# Altium project xkboard_rp2040.PrjPcb
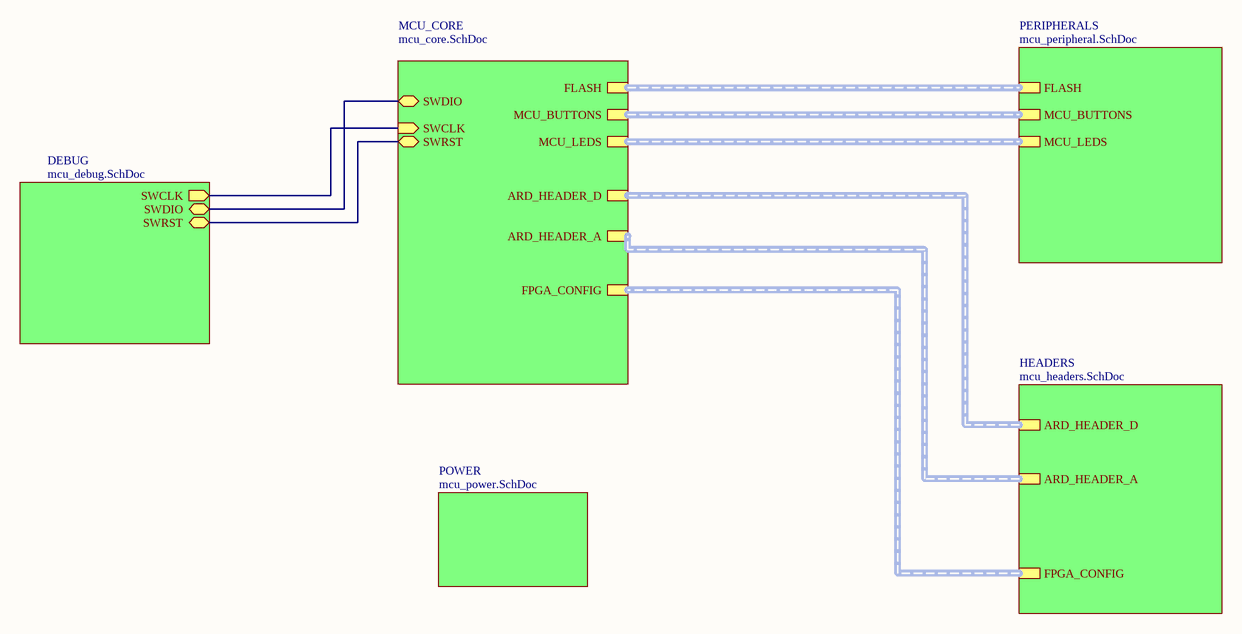
[diagram p0: arm_board.SchDoc]
6 sheets, 73 parts. Net scope: hierarchical (ports join the sheet entries above them; power ports are global).
Board file: rpi_board.PcbDoc
Sheets:
  arm_board.SchDoc
    MCU_CORE = mcu_core.SchDoc
    DEBUG = mcu_debug.SchDoc
    PERIPHERALS = mcu_peripheral.SchDoc
    POWER = mcu_power.SchDoc
    HEADERS = mcu_headers.SchDoc

## Sheet arm_board.SchDoc
size A4

### Sub-sheets
DEBUG = mcu_debug.SchDoc: SWCLK (out), SWDIO (bidir), SWRST (bidir)
HEADERS = mcu_headers.SchDoc: ARD_HEADER_D (harness ARD_HEADER_D), ARD_HEADER_A (harness ARD_HEADER_A), FPGA_CONFIG (harness FPGA_CONFIG)
MCU_CORE = mcu_core.SchDoc: SWDIO (bidir), SWRST (bidir), ARD_HEADER_A (harness ARD_HEADER_A), ARD_HEADER_D (harness ARD_HEADER_D), FPGA_CONFIG (harness FPGA_CONFIG), FLASH (harness FLASH), SWCLK (in), MCU_BUTTONS (harness MCU_BUTTONS), MCU_LEDS (harness MCU_LEDS)
PERIPHERALS = mcu_peripheral.SchDoc: FLASH (harness FLASH), MCU_BUTTONS (harness MCU_BUTTONS), MCU_LEDS (harness MCU_LEDS)
POWER = mcu_power.SchDoc: no entries

### Nets
NetIC1_24: sheet MCU_CORE/SWCLK, sheet DEBUG/SWCLK
NetIC1_25: sheet MCU_CORE/SWDIO, sheet DEBUG/SWDIO
NetP1_10: sheet MCU_CORE/SWRST, sheet DEBUG/SWRST

### Buses and harness runs
harness sheet HEADERS/ARD_HEADER_A = sheet MCU_CORE/ARD_HEADER_A
harness sheet HEADERS/ARD_HEADER_D = sheet MCU_CORE/ARD_HEADER_D
harness sheet HEADERS/FPGA_CONFIG = sheet MCU_CORE/FPGA_CONFIG
harness sheet MCU_CORE/FLASH = sheet PERIPHERALS/FLASH
harness sheet MCU_CORE/MCU_BUTTONS = sheet PERIPHERALS/MCU_BUTTONS
harness sheet MCU_CORE/MCU_LEDS = sheet PERIPHERALS/MCU_LEDS

## Sheet mcu_core.SchDoc
size A4; SheetNumber: 2; SheetTotal: 6
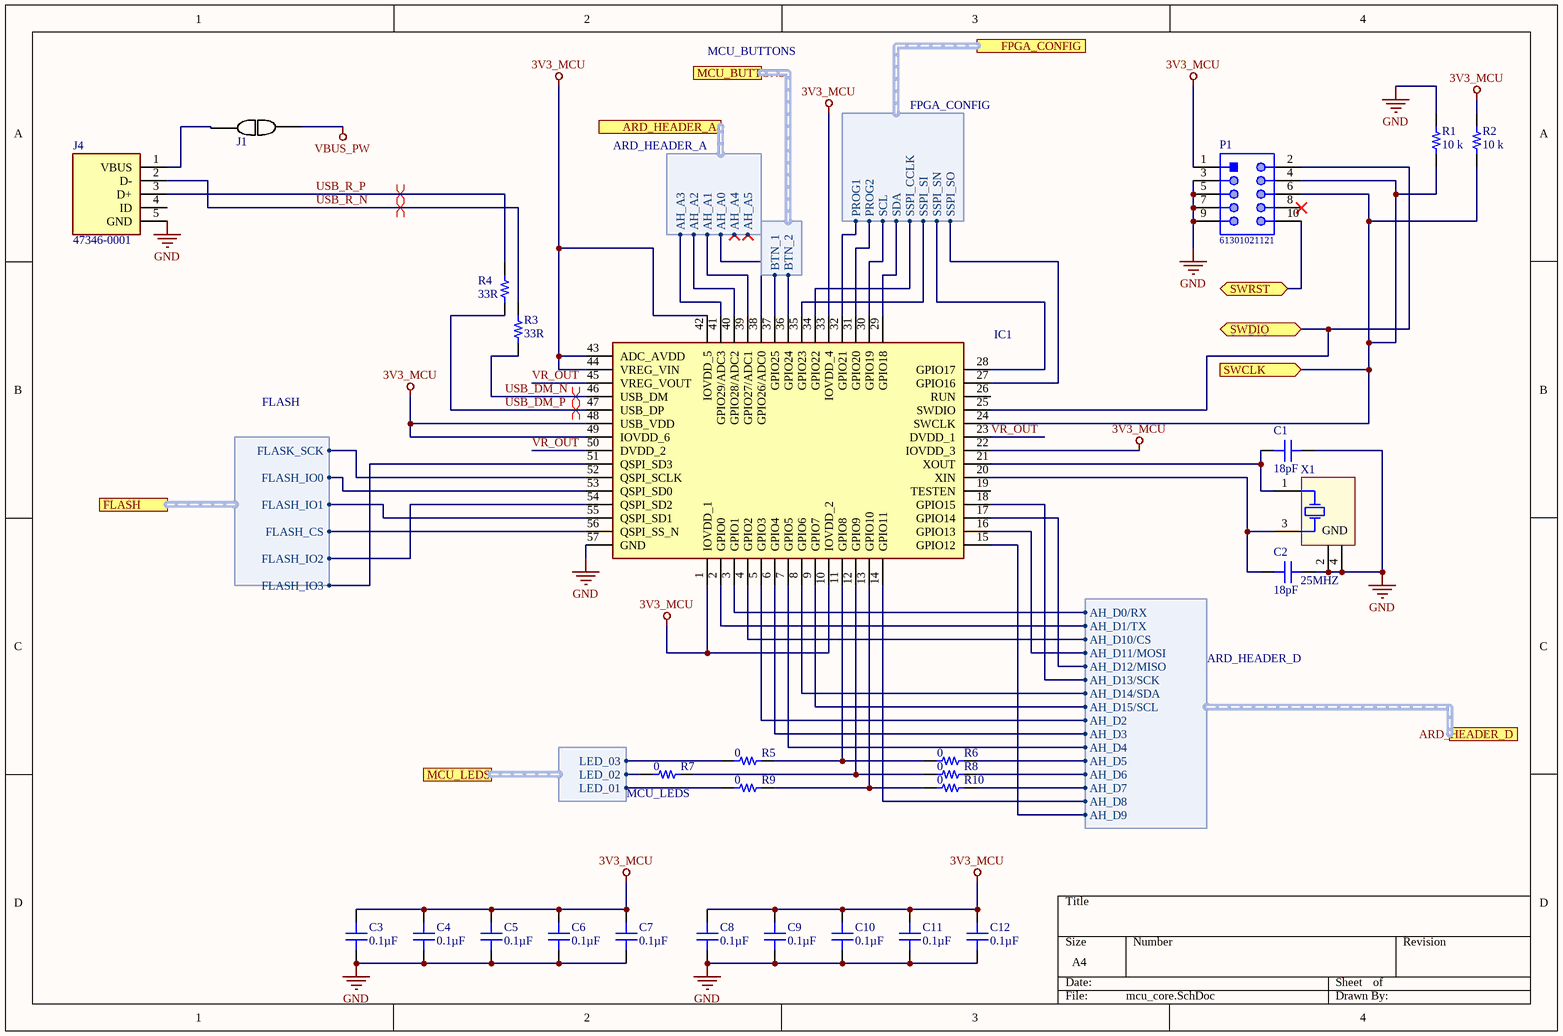
[diagram p1: mcu_core.SchDoc]

### Parts
C1  18pF  [CAP 0603_1608]
C2  18pF  [CAP 0603_1608]
C3  0.1µF  [CAP 0603_1608]
C4  0.1µF  [CAP 0603_1608]
C5  0.1µF  [CAP 0603_1608]
C6  0.1µF  [CAP 0603_1608]
C7  0.1µF  [CAP 0603_1608]
C8  0.1µF  [CAP 0603_1608]
C9  0.1µF  [CAP 0603_1608]
C10  0.1µF  [CAP 0603_1608]
C11  0.1µF  [CAP 0603_1608]
C12  0.1µF  [CAP 0603_1608]
IC1  (no value)  [QFN40P700X700X90-57N-D]
J1  103185-2  [HDRV2W89P0X254_1X2_467X234X820P]  (value not drawn)
J4  47346-0001  [47346-0001]
P1  61301021121  [61301021121]
R1  10 k  [RES 0603_1608]
R2  10 k  [RES 0603_1608]
R3  33R  [RES 0603_1608]
R4  33R  [RES 0603_1608]
R5  0  [RES 0603_1608]
R6  0  [RES 0603_1608]
R7  0  [RES 0603_1608]
R8  0  [RES 0603_1608]
R9  0  [RES 0603_1608]
R10  0  [RES 0603_1608]
X1  25MHZ  [ABRA-ABMM2-4_V]

### Ports
ARD_HEADER_A (harness ARD_HEADER_A), ARD_HEADER_D (harness ARD_HEADER_D), FLASH (harness FLASH), FPGA_CONFIG (harness FPGA_CONFIG), MCU_BUTTONS (harness MCU_BUTTONS), MCU_LEDS (harness MCU_LEDS), SWCLK (in), SWDIO (bidir), SWRST (bidir)

### Harnesses
ARD_HEADER_A: AH_A0, AH_A1, AH_A2, AH_A3, AH_A4, AH_A5
ARD_HEADER_D: AH_D0/RX, AH_D1/TX, AH_D10/CS, AH_D11/MOSI, AH_D12/MISO, AH_D13/SCK, AH_D14/SDA, AH_D15/SCL, AH_D2, AH_D3, AH_D4, AH_D5, AH_D6, AH_D7, AH_D8, AH_D9
FPGA_CONFIG: PROG1, PROG2, SCL, SDA, SSPI_CCLK, SSPI_SI, SSPI_SN, SSPI_SO
MCU_BUTTONS: BTN_1, BTN_2
MCU_LEDS: LED_01, LED_02, LED_03
FLASH: FLASH_IO3, FLASH_IO2, FLASH_CS, FLASH_IO1, FLASH_IO0, FLASK_SCK

### Nets
3V3_MCU: C3.2 C4.2 C5.2 C6.2 C7.2 C8.2 C9.2 C10.2 C11.2 C12.2 IC1.1(IOVDD_1) IC1.10(IOVDD_2) IC1.22(IOVDD_3) IC1.33(IOVDD_4) IC1.42(IOVDD_5) IC1.43(ADC_AVDD) IC1.44(VREG_VIN) IC1.48(USB_VDD) IC1.49(IOVDD_6) P1.1 R2.2
GND: C1.1 C2.1 C3.1 C4.1 C5.1 C6.1 C7.1 C8.1 C9.1 C10.1 C11.1 C12.1 IC1.57(GND) J4.5(GND) P1.3 P1.5 P1.7 P1.9 R1.2 X1.2(GND) X1.4(GND)
VBUS_PW: J1.1  [project net 5V]
USB_DM_N: IC1.46(USB_DM) R3.1
USB_DM_P: IC1.47(USB_DP) R4.2
USB_R_N: J4.2(D-) R3.2
USB_R_P: J4.3(D+) R4.1
VR_OUT: IC1.23(DVDD_1) IC1.45(VREG_VOUT) IC1.50(DVDD_2)
NetC1_2: C1.2 IC1.21(XOUT) X1.1(X1)
NetC2_2: C2.2 IC1.20(XIN) X1.3(X2)
NetD4_2: R9.1 ; port MCU_LEDS.LED_01
NetD5_2: R7.1 ; port MCU_LEDS.LED_02
NetD6_2: R5.1 ; port MCU_LEDS.LED_03
NetIC1_2: IC1.2(GPIO0) ; port ARD_HEADER_D.AH_D1/TX
NetIC1_3: IC1.3(GPIO1) ; port ARD_HEADER_D.AH_D0/RX
NetIC1_4: IC1.4(GPIO2) ; port ARD_HEADER_D.AH_D10/CS
NetIC1_5: IC1.5(GPIO3) ; port ARD_HEADER_D.AH_D2
NetIC1_6: IC1.6(GPIO4) ; port ARD_HEADER_D.AH_D3
NetIC1_7: IC1.7(GPIO5) ; port ARD_HEADER_D.AH_D4
NetIC1_8: IC1.8(GPIO6) ; port ARD_HEADER_D.AH_D14/SDA
NetIC1_9: IC1.9(GPIO7) ; port ARD_HEADER_D.AH_D15/SCL
NetIC1_11: IC1.11(GPIO8) R5.2 R6.1
NetIC1_12: IC1.12(GPIO9) R7.2 R8.1
NetIC1_13: IC1.13(GPIO10) R9.2 R10.1
NetIC1_14: IC1.14(GPIO11) ; port ARD_HEADER_D.AH_D8
NetIC1_15: IC1.15(GPIO12) ; port ARD_HEADER_D.AH_D9
NetIC1_16: IC1.16(GPIO13) ; port ARD_HEADER_D.AH_D11/MOSI
NetIC1_17: IC1.17(GPIO14) ; port ARD_HEADER_D.AH_D12/MISO
NetIC1_18: IC1.18(GPIO15) ; port ARD_HEADER_D.AH_D13/SCK
NetIC1_24: IC1.24(SWCLK) P1.4 P1.6 R1.1 R2.1 ; port SWCLK
NetIC1_25: IC1.25(SWDIO) P1.2 ; port SWDIO
NetIC1_27: IC1.27(GPIO16) ; port FPGA_CONFIG.SSPI_SO
NetIC1_28: IC1.28(GPIO17) ; port FPGA_CONFIG.SSPI_SN
NetIC1_29: IC1.29(GPIO18) ; port FPGA_CONFIG.SDA
NetIC1_30: IC1.30(GPIO19) ; port FPGA_CONFIG.SCL
NetIC1_31: IC1.31(GPIO20) ; port FPGA_CONFIG.PROG2
NetIC1_32: IC1.32(GPIO21) ; port FPGA_CONFIG.PROG1
NetIC1_34: IC1.34(GPIO22) ; port FPGA_CONFIG.SSPI_CCLK
NetIC1_35: IC1.35(GPIO23) ; port FPGA_CONFIG.SSPI_SI
NetIC1_36: IC1.36(GPIO24) ; port MCU_BUTTONS.BTN_2
NetIC1_37: IC1.37(GPIO25) ; port MCU_BUTTONS.BTN_1
NetIC1_38: IC1.38(GPIO26/ADC0) ; port ARD_HEADER_A.AH_A0
NetIC1_39: IC1.39(GPIO27/ADC1) ; port ARD_HEADER_A.AH_A1
NetIC1_40: IC1.40(GPIO28/ADC2) ; port ARD_HEADER_A.AH_A2
NetIC1_41: IC1.41(GPIO29/ADC3) ; port ARD_HEADER_A.AH_A3
NetIC1_51: IC1.51(QSPI_SD3) ; port FLASH.FLASH_IO3
NetIC1_52: IC1.52(QSPI_SCLK) ; port FLASH.FLASK_SCK
NetIC1_53: IC1.53(QSPI_SD0) ; port FLASH.FLASH_IO0
NetIC1_54: IC1.54(QSPI_SD2) ; port FLASH.FLASH_IO2
NetIC1_55: IC1.55(QSPI_SD1) ; port FLASH.FLASH_IO1
NetIC1_56: IC1.56(QSPI_SS_N) ; port FLASH.FLASH_CS
NetJ1_2: J1.2 J4.1(VBUS)
NetJ3_20: R6.2 ; port ARD_HEADER_D.AH_D5
NetJ3_21: R8.2 ; port ARD_HEADER_D.AH_D6
NetJ3_22: R10.2 ; port ARD_HEADER_D.AH_D7
NetP1_10: P1.10 ; port SWRST

Not connected (* = marked no-connect by the designer): IC1 19(TESTEN) 26(RUN); J4 4(ID); P1 8*

### Layout directives
differential pair: USB_DM_N, USB_DM_P, USB_R_N, USB_R_P

### Library data of the parts
C1 C2 = VJ0603A180FXQCW1BC: CAP CER 18PF 10V C0G/NP0 0603; Manufacturer: Vishay Vitramon; Temperature Coefficient: C0G, NP0; Tolerance: ±1%; Part Number: VJ0603A180FXQCW1BC; Value: 18pF; Applications: General Purpose; Capacitance: 18pF; ComponentLink1Description: Datasheet; ComponentLink1URL: https://www.vishay.com/docs/28548/vjw1bcbascomseries.pdf; ComponentLink2Description: DigiKey Link; ComponentLink2URL: http://digikey.com/product-detail/en/vishay-vitramon/VJ0603A180FXQCW1BC/720-1660-1-ND/8324080; Device Package: 0603 (1608 Metric); LastUpdated: 02.09.2020 1:03:27; Lifecycle Status: Active; Minimum Order: 1; Mounting Type: Surface Mount, MLCC; Operating Temperature: -55°C ~ 125°C; Package / Case: 0603 (1608 Metric); Packaging: TapeAndReel; PartId: 7094; Part Status: Active; Price: 0.04; Series: VJ; Size / Dimension: 0.063" L x 0.031" W (1.60mm x 0.80mm); Supplier 1: DigiKey; Supplier Part Number 1: 720-1660-1-ND; Thickness (Max): 0.034" (0.87mm); Voltage - Rated: 10V
C3-C12 = C0603C104K5RAC7411: CAP CER 0.1UF 50V X7R 0603; Manufacturer: KEMET; Tolerance: ±10%; Part Number: C0603C104K5RAC7411; Value: 0.1µF; Applications: Bypass, Decoupling; Capacitance: 0.1µF; ComponentLink1Description: Datasheet; ComponentLink1URL: https://api.kemet.com/component-edge/download/datasheet/C0603C104K5RAC7411.pdf; ComponentLink2Description: DigiKey Link; ComponentLink2URL: http://digikey.com/product-detail/en/kemet/C0603C104K5RAC7411/399-7374-2-ND/3317013; Device Package: 0603 (1608 Metric); LastUpdated: 02.09.2020 1:03:36; Lifecycle Status: Active; Minimum Order: 15000; Mounting Type: Surface Mount, MLCC; Operating Temperature: -55°C ~ 125°C; Package / Case: 0603 (1608 Metric); Packaging: TapeAndReel; PartId: 2233; Part Status: Active; Price: 0.02; Series: SMD Comm X7R; Size / Dimension: 0.063" L x 0.031" W (1.60mm x 0.80mm); Supplier 1: DigiKey; Supplier Part Number 1: 399-7374-2-ND; Temperature Coefficient: X7R; Thickness (Max): 0.035" (0.90mm); Voltage - Rated: 50V
IC1 = RP2040: Integrated Circuit; Manufacturer_Name: RASPBERRY-PI; Datasheet Link: https://datasheets.raspberrypi.org/rp2040/rp2040-datasheet.pdf; Height: 0.9mm; Manufacturer_Part_Number: RP2040
J1 = 103185-2: 02 MODII HDR SRST B/A .100CL; Package: None; Price: None; Value: *; MP: 103185-2; Availability: Unavailable
J4 = 47346-0001: Connector; Manufacturer_Name: Molex; Datasheet Link: http://www.molex.com/pdm_docs/sd/473460001_sd.pdf; Manufacturer_Part_Number: 47346-0001; Mouser Part Number: 538-47346-0001; Mouser Price/Stock: https://www.mouser.co.uk/ProductDetail/Molex/47346-0001?qs=c2CV6XM0DweJBWaSeyWeCw%3D%3D
P1 = CMP-1502-01084-1: THT Vertical Pin Header WR-PHD, Pitch 2.54 mm, Dual Row, 10 pins; Manufacturer: Wurth Elektronik; Working Voltage: 250VAC; Pitch: 2.54mm; Contact Resistance: 20mOhm; Gender: Male; Rated Current: 3A; Withstanding Voltage: 500VAC; Pin Number: 10; Operating Temperature: -40to105degC; Mounting Technology: THT; Publisher: WurthElektronik; Manufacturer URL: http://www.we-online.de; Part Number: 61301021121; Row Number: Dual; Packaging: Bag; Orientation: Vertical; Package Reference: 61301021121; Datasheet URL: https://katalog.we-online.de/em/datasheet/6130xx21121.pdf
R1 R2 = RNCS0603BKE10K0: RES 10K OHM 0.1% 1/16W 0603; Manufacturer: Stackpole Electronics Inc; Power (Watts): 0.063W, 1/16W; Resistance: 10 kOhms; Temperature Coefficient: ±25ppm/°C; Part Number: RNCS0603BKE10K0; Value: 10 k; ComponentLink1Description: Datasheet; ComponentLink1URL: https://www.seielect.com/catalog/sei-rncs_rnch.pdf; ComponentLink2Description: DigiKey Link; ComponentLink2URL: http://digikey.com/product-detail/en/stackpole-electronics-inc/RNCS0603BKE10K0/RNCS0603BKE10K0CT-ND/1800113; Composition: Thin Film; Device Package: 0603 (1608 Metric); Features: Anti-Corrosive, Automotive AEC-Q200, Moisture Resistant; Height - Seated (Max): 0.022" (0.55mm); LastUpdated: 02.09.2020 1:10:25; Lifecycle Status: Active; Minimum Order: 1; Number of Terminations: 2; Operating Temperature: -55°C ~ 155°C; Package / Case: 0603 (1608 Metric); Packaging: TapeAndReel; PartId: 4838; Part Status: Active; Price: 0.08; Ratings: AEC-Q200; Series: RNCS; Size / Dimension: 0.061" L x 0.031" W (1.55mm x 0.80mm); Supplier 1: DigiKey; Supplier Part Number 1: RNCS0603BKE10K0CT-ND; Supplier Device Package: 0603; Tolerance: ±0.1%
R3 R4 = CPF0603B33RE: RES SMD 33 OHM 0.1% 1/16W 0603; Manufacturer: TE Connectivity Passive Product; Power (Watts): 0.063W, 1/16W; Resistance: 33 Ohms; Temperature Coefficient: ±25ppm/°C; Part Number: CPF0603B33RE; Value: 33R; ComponentLink1Description: Datasheet; ComponentLink1URL: https://www.te.com/commerce/DocumentDelivery/DDEController?Action=srchrtrv&DocNm=1773200&DocType=DS&DocLang=English; ComponentLink2Description: DigiKey Link; ComponentLink2URL: http://digikey.com/product-detail/en/te-connectivity-passive-product/CPF0603B33RE/A119909CT-ND/4966507; Composition: Thin Film; Device Package: 0603 (1608 Metric); Height - Seated (Max): 0.022" (0.55mm); LastUpdated: 02.09.2020 1:10:25; Lifecycle Status: Active; Minimum Order: 1; Number of Terminations: 2; Operating Temperature: -55°C ~ 155°C; Package / Case: 0603 (1608 Metric); Packaging: TapeAndReel; PartId: 4881; Part Status: Active; Price: 0.09; Series: CPF, Neohm; Size / Dimension: 0.061" L x 0.031" W (1.55mm x 0.80mm); Supplier 1: DigiKey; Supplier Part Number 1: A119909CT-ND; Supplier Device Package: 0603; Tolerance: ±0.1%
R5-R10 = TLRZ1JTTD: RES 0 OHM JUMPER 0603; Manufacturer: KOA Speer Electronics, Inc.; Part Number: TLRZ1JTTD; ComponentLink1Description: Datasheet; ComponentLink1URL: http://www.koaspeer.com/catimages/Products/TLRZ/TLRZ.pdf; ComponentLink2Description: DigiKey Link; ComponentLink2URL: http://digikey.com/product-detail/en/koa-speer-electronics-inc/TLRZ1JTTD/2019-TLRZ1JTTDCT-ND/9847537; Composition: Metal Element; Device Package: 0603 (1608 Metric); Features: Automotive AEC-Q200, Current Sense; Height - Seated (Max): 0.022" (0.55mm); LastUpdated: 02.09.2020 1:10:25; Lifecycle Status: Active; Minimum Order: 1; Number of Terminations: 2; Operating Temperature: -55°C ~ 170°C; Package / Case: 0603 (1608 Metric); Packaging: TapeAndReel; PartId: 4851; Part Status: Active; Price: 0.08; Ratings: AEC-Q200; Series: TLRZ; Size / Dimension: 0.063" L x 0.031" W (1.60mm x 0.80mm); Supplier 1: DigiKey; Supplier Part Number 1: 2019-TLRZ1JTTDCT-ND; Supplier Device Package: 0603; Tolerance: Jumper
X1 = CMP-0277-00003-1: Ceramic Surface Mount Low Profile Quartz Crystal, 8 MHz, -20 to 70 degC, 4-Pin 6 x 3.6 x 1.2 mm SMD, RoHS, 1000pcs / Reel; Manufacturer: Abracon; PartNumber: ABMM2-8.000MHZ-E2-T; ESR: 72 Ohm Max.; Frequency: 8 MHz; Shunt Capacitance C0: 7 pF Max.; Load Capacitance CL: 18 pF Typ.; ComponentLink3Description: Package Specification; PackageDescription: 4-Pin SMD, Body 6 x 3.6 mm, Pitch 4.4 mm; DatasheetVersion: Jan-13; ComponentLink1URL: http://www.abracon.com/; ComponentLink2URL: http://www.abracon.com/Resonators/ABMM2.pdf; Temperature Range: -20 to 70 degC; Mounting Technology: Surface Mount; RoHS: TRUE; ComponentLink2Description: Datasheet; ComponentLink3URL: http://www.abracon.com/Resonators/ABMM2.pdf; ComponentLink1Description: Manufacturer URL; Packing: 1000pcs / Reel

## Sheet mcu_debug.SchDoc: ARM debug probe
size A4; Author: Pavel Koupý; Revision: 1.0; SheetNumber: 3; SheetTotal: 6
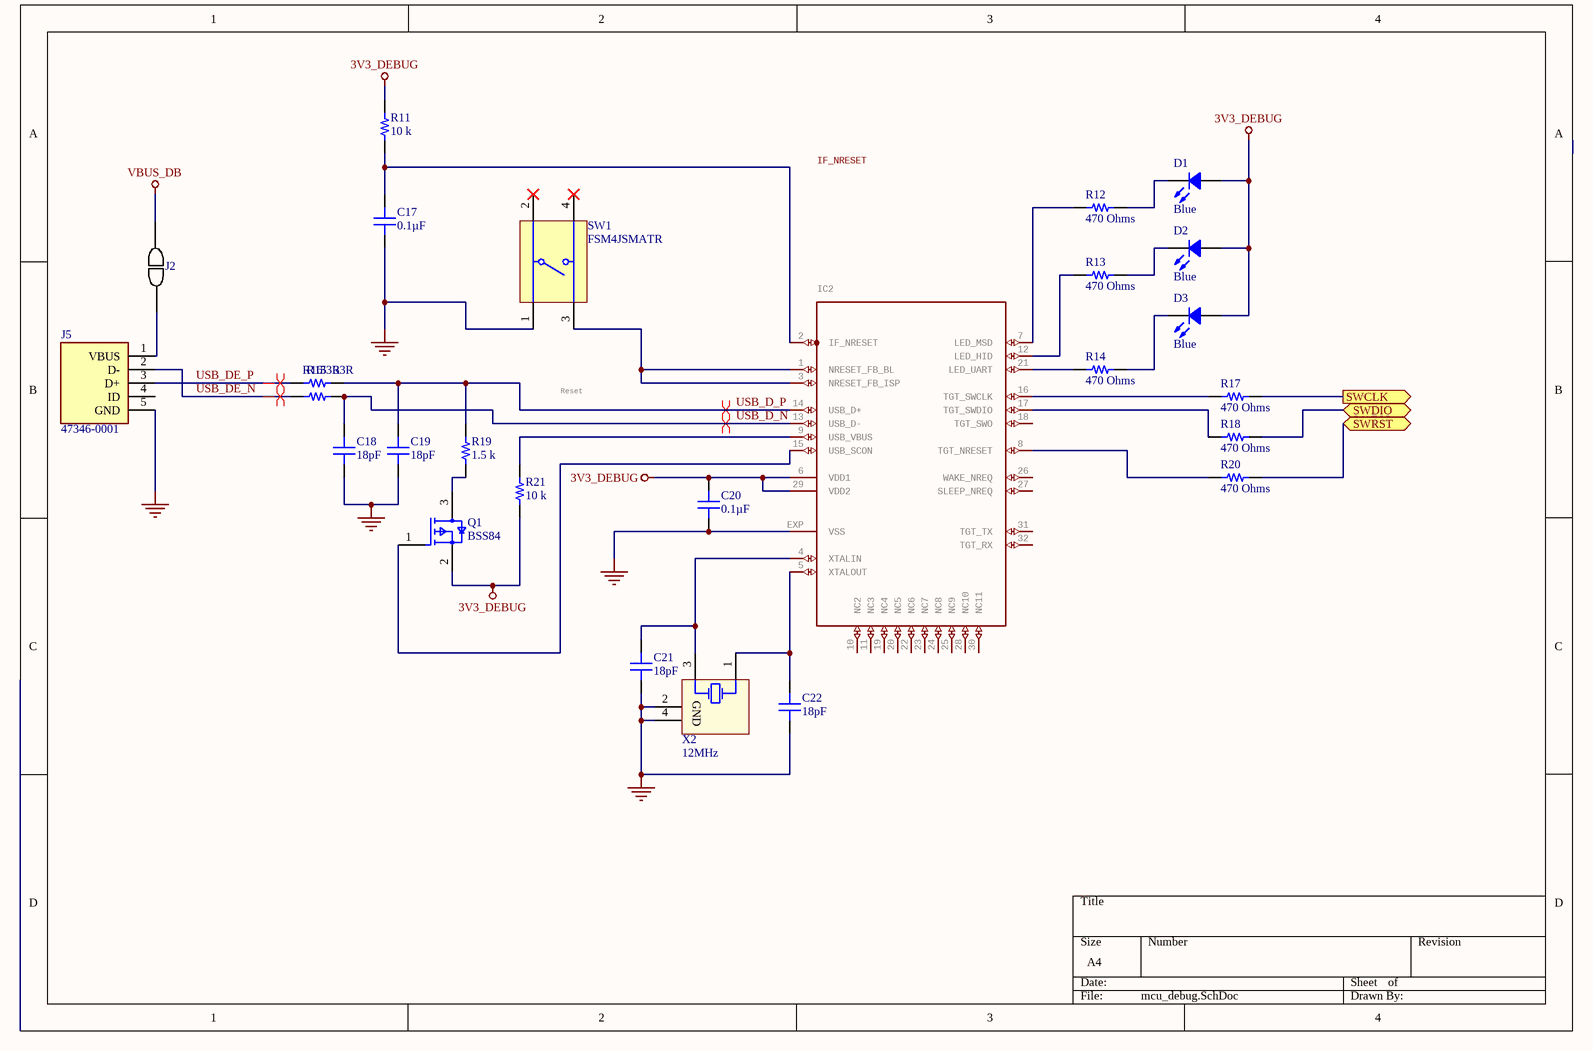
[diagram p2: mcu_debug.SchDoc]

### Parts
C17  0.1µF  [CAP 0603_1608]
C18  18pF  [CAP 0603_1608]
C19  18pF  [CAP 0603_1608]
C20  0.1µF  [CAP 0603_1608]
C21  18pF  [CAP 0603_1608]
C22  18pF  [CAP 0603_1608]
D1  Blue  [LED 0603_1608 BLUE]
D2  Blue  [LED 0603_1608 BLUE]
D3  Blue  [LED 0603_1608 BLUE]
IC2  CMSIS-DAP Interface : 32-bit LPC11U00 ARM Cortex M3 RISC 64KB Flash 2.5V/3.3V 33-Pin HVQFN EP  [HVQFN33]  (value not drawn)
J2  103185-2  [HDRV2W89P0X254_1X2_467X234X820P]  (value not drawn)
J5  47346-0001  [47346-0001]
Q1  BSS84  [FP-SOT23-MFG]
R11  10 k  [RES 0603_1608]
R12  470 Ohms  [RES 0603_1608]
R13  470 Ohms  [RES 0603_1608]
R14  470 Ohms  [RES 0603_1608]
R15  33R  [RES 0603_1608]
R16  33R  [RES 0603_1608]
R17  470 Ohms  [RES 0603_1608]
R18  470 Ohms  [RES 0603_1608]
R19  1.5 k  [RES 0603_1608]
R20  470 Ohms  [RES 0603_1608]
R21  10 k  [RES 0603_1608]
SW1  FSM4JSMATR  [TECO-FSM4JSMATR_V]
X2  12MHz  [ABRA-ABMM2-4_V]

### Ports
SWCLK (out), SWDIO (bidir), SWRST (bidir)

### Nets
3V3_DEBUG: C20.2 D1.1 D2.1 D3.1 IC2.6(VDD1) IC2.29(VDD2) Q1.2(S) R11.2 R21.1
GND: C17.1 C18.1 C19.1 C20.1 C21.1 C22.1 IC2.EXP(VSS) J5.5(GND) SW1.1 X2.2(GND) X2.4(GND)
VBUS_DB: J2.1  [project net 5V]
USB_D_N: C18.2 IC2.13(USB_D-) R15.2
USB_D_P: C19.2 IC2.14(USB_D+) R16.2 R19.2
USB_DE_N: J5.2(D-) R15.1
USB_DE_P: J5.3(D+) R16.1
NetC17_2: C17.2 IC2.2(IF_NRESET) R11.1
NetC21_2: C21.2 IC2.4(XTALIN) X2.3(X2)
NetC22_2: C22.2 IC2.5(XTALOUT) X2.1(X1)
NetD1_2: D1.2 R12.2
NetD2_2: D2.2 R13.2
NetD3_2: D3.2 R14.2
NetIC1_24: R17.2 ; port SWCLK
NetIC1_25: R18.2 ; port SWDIO
NetIC2_1: IC2.1(NRESET_FB_BL) IC2.3(NRESET_FB_ISP) SW1.3
NetIC2_7: IC2.7(LED_MSD) R12.1
NetIC2_8: IC2.8(TGT_NRESET) R20.1
NetIC2_9: IC2.9(USB_VBUS) R21.2
NetIC2_12: IC2.12(LED_HID) R13.1
NetIC2_15: IC2.15(USB_SCON) Q1.1(G)
NetIC2_16: IC2.16(TGT_SWCLK) R17.1
NetIC2_17: IC2.17(TGT_SWDIO) R18.1
NetIC2_21: IC2.21(LED_UART) R14.1
NetJ2_2: J2.2 J5.1(VBUS)
NetP1_10: R20.2 ; port SWRST
NetQ1_3: Q1.3(D) R19.1

Not connected (* = marked no-connect by the designer): IC2 10(NC2) 11(NC3) 18(TGT_SWO) 19(NC4) 20(NC5) 22(NC6) 23(NC7) 24(NC8) 25(NC9) 26(WAKE_NREQ) 27(SLEEP_NREQ) 28(NC10) 30(NC11) 31(TGT_TX) 32(TGT_RX); J5 4(ID); SW1 2* 4*

### Layout directives
differential pair: USB_D_N, USB_D_P, USB_DE_N, USB_DE_P

### Notes on the sheet
- Reset
- Labels drawn without touching a wire or pin: IF_NRESET

### Library data of the parts
C17 C20 = C0603T104K8RAC7867: CAP CER 0.1UF 10V X7R 0603; Manufacturer: KEMET; Ratings: COTS; Tolerance: ±10%; Part Number: C0603T104K8RAC7867; Value: 0.1µF; Applications: High Reliability, Bypass, Decoupling; Capacitance: 0.1µF; ComponentLink1Description: Datasheet; ComponentLink1URL: https://api.kemet.com/component-edge/download/datasheet/C0603T104K8RAC7867.pdf; ComponentLink2Description: DigiKey Link; ComponentLink2URL: http://digikey.com/product-detail/en/kemet/C0603T104K8RAC7867/399-20424-1-ND/9925028; Device Package: 0603 (1608 Metric); LastUpdated: 02.09.2020 1:03:35; Lifecycle Status: Active; Minimum Order: 1; Mounting Type: Surface Mount, MLCC; Operating Temperature: -55°C ~ 125°C; Package / Case: 0603 (1608 Metric); Packaging: TapeAndReel; PartId: 2528; Part Status: Active; Price: 0.23; Series: SMD COTS X7R; Size / Dimension: 0.063" L x 0.031" W (1.60mm x 0.80mm); Supplier 1: DigiKey; Supplier Part Number 1: 399-20424-1-ND; Temperature Coefficient: X7R; Thickness (Max): 0.034" (0.87mm); Voltage - Rated: 10V
C18 C19 C21 C22 = VJ0603A180FXQCW1BC: as C1 on sheet mcu_core; Part Number: VJ0603A180FXQCW1BC; Value: 18pF; Applications: General Purpose; Capacitance: 18pF; ComponentLink1Description: Datasheet; ComponentLink1URL: https://www.vishay.com/docs/28548/vjw1bcbascomseries.pdf; ComponentLink2Description: DigiKey Link; ComponentLink2URL: http://digikey.com/product-detail/en/vishay-vitramon/VJ0603A180FXQCW1BC/720-1660-1-ND/8324080; Device Package: 0603 (1608 Metric); LastUpdated: 02.09.2020 1:03:27; Lifecycle Status: Active; Minimum Order: 1; Mounting Type: Surface Mount, MLCC; Operating Temperature: -55°C ~ 125°C; Package / Case: 0603 (1608 Metric); Packaging: TapeAndReel; PartId: 7094; Part Status: Active; Price: 0.04; Series: VJ; Size / Dimension: 0.063" L x 0.031" W (1.60mm x 0.80mm); Supplier 1: DigiKey; Supplier Part Number 1: 720-1660-1-ND; Thickness (Max): 0.034" (0.87mm); Voltage - Rated: 10V
D1-D3 = VLMB1300-GS08: LED BLUE 0603 SMD; Manufacturer: Vishay Semiconductor Opto Division; Configuration: Standard; Current - Test: 20mA; Lens Color: 1.00mm; Lens Size: 1.10mm x 0.80mm; Lens Style: Rectangle with Flat Top; Millicandela Rating: 104mcd; Viewing Angle: 130°; Voltage - Forward (Vf) (Typ): 3.3V; Wavelength - Dominant: 470nm; Wavelength - Peak: 468nm; Part Number: VLMB1300-GS08; Color: Blue; ComponentLink1Description: Datasheet; ComponentLink1URL: http://www.vishay.com/docs/82437/vlmo1300.pdf; ComponentLink2Description: DigiKey Link; ComponentLink2URL: http://digikey.com/product-detail/en/vishay-semiconductor-opto-division/VLMB1300-GS08/VLMB1300-GS08CT-ND/3025485; Device Package: 0603 (1608 Metric); Height (Max): 1.00mm; LastUpdated: 02.09.2020 1:20:26; Lifecycle Status: Active; Minimum Order: 1; Mounting Type: Surface Mount; Package / Case: 0603 (1608 Metric); Packaging: TapeAndReel; PartId: 785; Part Status: Active; Price: 0.08; Series: CHIPLED; Size / Dimension: 1.60mm L x 0.80mm W; Supplier 1: DigiKey; Supplier Part Number 1: VLMB1300-GS08CT-ND; Supplier Device Package: 0603; Value: Blue
IC2 = IF_LPC11U35FHI33/501: GateName_1: G$1; SymbolName_1: IF-LPC11U35; MF: NXP; LibraryName: mbed-HDK-MF-NXP; DeviceSetName: IF_LPC11U35FHI33/501; Package: HVQFN33; MFN: LPC11U35FHI33/501; OC-DIGIKEY: 568-9586-ND; OC-MOUSER: 771-LPC11U35FHI33501; OC-NEWARK: 2115658; Supplier 1: Farnell; Supplier Part Number 1: 2115658
J2 = 103185-2: 02 MODII HDR SRST B/A .100CL; Package: None; Price: None; Value: *; MP: 103185-2; Availability: Unavailable
J5 = 47346-0001: Connector; Manufacturer_Name: Molex; Datasheet Link: http://www.molex.com/pdm_docs/sd/473460001_sd.pdf; Manufacturer_Part_Number: 47346-0001; Mouser Part Number: 538-47346-0001; Mouser Price/Stock: https://www.mouser.co.uk/ProductDetail/Molex/47346-0001?qs=c2CV6XM0DweJBWaSeyWeCw%3D%3D
Q1 = CMP-14409-000006-1: MOSFET P-CH 50V 130MA SOT-23; Manufacturer Part Number: BSS84,215; Manufacturer: Nexperia USA Inc.; Drain To Source Breakdown Voltage: -50V; Max Junction Temp: +150°C; Threshold Vgs Min: -0.8V; Turn On Delay Time: 3ns; Power Dissipation: 250mW; Turn Off Delay Time: 7ns; Gate To Source Voltage: 20V; Number Of Channels: 1; Input Capacitace At Vds: 25pF @ -25V; Threshold Vgs Max: -2V; Continuous Drain Current: -130mA; Depletion Mode: False; Drain To Source Resistance: 6Ω; Rthja Max: 500K/W; Octopart: https://octopart.com/bss84%2C215-nexperia-78739375; Ipc Land Pattern Name: SOT95P230X100-3; Drain To Source Voltage: -50V; Lead Free: Yes; Temperature Range High: +150°C; Automotive: No; Device Class L2: Transistors; Package: SOT23; ComponentLink2URL: https://assets.nexperia.com/documents/data-sheet/BSS84.pdf; Category: Trans; RoHS: TRUE; Temperature Range Low: -65°C; ComponentLink2Description: Datasheet; Device Class L1: Discrete Semiconductors; Number Of P Channels: 1; Device Class L3: MOSFETs; Height: 1.1mm; Digikey Description: MOSFET P-CH 50V 130MA SOT-23; Temperature: -65°C to +150°C; Footprint Url: https://assets.nexperia.com/documents/outline-drawing/SOT23.pdf
R11 R21 = RNCS0603BKE10K0: as R1 on sheet mcu_core; Part Number: RNCS0603BKE10K0; Value: 10 k; ComponentLink1Description: Datasheet; ComponentLink1URL: https://www.seielect.com/catalog/sei-rncs_rnch.pdf; ComponentLink2Description: DigiKey Link; ComponentLink2URL: http://digikey.com/product-detail/en/stackpole-electronics-inc/RNCS0603BKE10K0/RNCS0603BKE10K0CT-ND/1800113; Composition: Thin Film; Device Package: 0603 (1608 Metric); Features: Anti-Corrosive, Automotive AEC-Q200, Moisture Resistant; Height - Seated (Max): 0.022" (0.55mm); LastUpdated: 02.09.2020 1:10:25; Lifecycle Status: Active; Minimum Order: 1; Number of Terminations: 2; Operating Temperature: -55°C ~ 155°C; Package / Case: 0603 (1608 Metric); Packaging: TapeAndReel; PartId: 4838; Part Status: Active; Price: 0.08; Ratings: AEC-Q200; Series: RNCS; Size / Dimension: 0.061" L x 0.031" W (1.55mm x 0.80mm); Supplier 1: DigiKey; Supplier Part Number 1: RNCS0603BKE10K0CT-ND; Supplier Device Package: 0603; Tolerance: ±0.1%
R12-R14 R17 R18 R20 = CRCW0603470RJNEAHP: RES SMD 470 OHM 5% 1/4W 0603; Manufacturer: Vishay Dale; Power (Watts): 0.25W, 1/4W; Temperature Coefficient: ±200ppm/°C; Part Number: CRCW0603470RJNEAHP; Value: 470 Ohms; ComponentLink1Description: Datasheet; ComponentLink1URL: http://www.vishay.com/docs/20043/crcwhpe3.pdf; ComponentLink2Description: DigiKey Link; ComponentLink2URL: http://digikey.com/product-detail/en/vishay-dale/CRCW0603470RJNEAHP/541-470SACT-ND/2222809; Composition: Thick Film; Device Package: 0603 (1608 Metric); Features: Automotive AEC-Q200, Pulse Withstanding; Height - Seated (Max): 0.022" (0.55mm); LastUpdated: 02.09.2020 1:09:49; Lifecycle Status: Active; Minimum Order: 1; Number of Terminations: 2; Operating Temperature: -55°C ~ 155°C; Package / Case: 0603 (1608 Metric); Packaging: TapeAndReel; PartId: 21320; Part Status: Active; Price: 0.02; Ratings: AEC-Q200; Resistance: 470 Ohms; Series: CRCW-HP; Size / Dimension: 0.063" L x 0.033" W (1.60mm x 0.85mm); Supplier 1: DigiKey; Supplier Part Number 1: 541-470SACT-ND; Supplier Device Package: 0603; Tolerance: ±5%
R15 R16 = CPF0603B33RE: as R3 on sheet mcu_core; Part Number: CPF0603B33RE; Value: 33R; ComponentLink1Description: Datasheet; ComponentLink1URL: https://www.te.com/commerce/DocumentDelivery/DDEController?Action=srchrtrv&DocNm=1773200&DocType=DS&DocLang=English; ComponentLink2Description: DigiKey Link; ComponentLink2URL: http://digikey.com/product-detail/en/te-connectivity-passive-product/CPF0603B33RE/A119909CT-ND/4966507; Composition: Thin Film; Device Package: 0603 (1608 Metric); Height - Seated (Max): 0.022" (0.55mm); LastUpdated: 02.09.2020 1:10:25; Lifecycle Status: Active; Minimum Order: 1; Number of Terminations: 2; Operating Temperature: -55°C ~ 155°C; Package / Case: 0603 (1608 Metric); Packaging: TapeAndReel; PartId: 4881; Part Status: Active; Price: 0.09; Series: CPF, Neohm; Size / Dimension: 0.061" L x 0.031" W (1.55mm x 0.80mm); Supplier 1: DigiKey; Supplier Part Number 1: A119909CT-ND; Supplier Device Package: 0603; Tolerance: ±0.1%
R19 = CRGP0603F1K5: CRGP 0603 1K5 1%; Manufacturer: TE Connectivity Passive Product; Power (Watts): 0.25W, 1/4W; Resistance: 1.5 kOhms; Temperature Coefficient: ±100ppm/°C; Part Number: CRGP0603F1K5; Value: 1.5 k; ComponentLink1Description: Datasheet; ComponentLink1URL: https://www.te.com/commerce/DocumentDelivery/DDEController?Action=srchrtrv&DocNm=9-1773463-9&DocType=DS&DocLang=English; ComponentLink2Description: DigiKey Link; ComponentLink2URL: http://digikey.com/product-detail/en/te-connectivity-passive-product/CRGP0603F1K5/A130418CT-ND/8578250; Composition: Thick Film; Device Package: 0603 (1608 Metric); Features: Pulse Withstanding; Height - Seated (Max): 0.022" (0.55mm); LastUpdated: 02.09.2020 1:10:24; Lifecycle Status: Active; Minimum Order: 1; Number of Terminations: 2; Operating Temperature: -55°C ~ 155°C; Package / Case: 0603 (1608 Metric); Packaging: TapeAndReel; PartId: 5000; Part Status: Active; Price: 0.02; Series: CRGP; Size / Dimension: 0.063" L x 0.031" W (1.60mm x 0.80mm); Supplier 1: DigiKey; Supplier Part Number 1: A130418CT-ND; Supplier Device Package: 0603; Tolerance: ±1%
SW1 = CMP-2000-07486-1: Micro Miniature Push Button Switch FSM JSM, 50 mA, -35 to 85 degC, 4-Pin SMD, RoHS, Tape and Reel; Manufacturer: TE Connectivity; Mechanical Life: 100000Cycles; Current Rating: 50mA; Actuator Material: Polyamide; Max Voltage Rating (DC): 12V; Capacitance: 0f; Illumination Type: Illuminated; Voltage Rating (DC): 24V; Case\/Package: SMD/SMT; Operating Force: 160gf; Contact Resistance: 100mOhm; Actuator Length: 0.055inch; Switch Travel: 0.25mm; Throw Configuration: SPST; Termination: GullWing; Contact Plating: Silver; Orientation: Straight; Mounting Technology: SurfaceMount; REACH SVHC: Unknown; Electrical Life: 100000Cycles; Package Reference: FSM4JSMATR; Max Operating Temperature: 85degC; Manufacturer URL: http://www.te.com/; Package Description: 4-Pin Surface Mount Device, Body 6 x 6 mm, Pitch 4.5 mm; Datasheet Version: Rev. V, 02/2015; Packaging: TapeandReel; Min Operating Temperature: -35degC; Mount: SurfaceMount; Contact Current Rating: 50mA; Contact Material: CopperAlloy; Package Quantity: 1200; Datasheet URL: http://www.te.com/commerce/DocumentDelivery/DDEController?Action=showdoc&DocId=Customer+Drawing%7F2-1437565-7%7FV%7Fpdf%7FEnglish%7FENG_CD_2-1437565-7_V.pdf%7F4-1437565-2; RoHSCompliant: true
X2 = CMP-0277-00003-1: as X1 on sheet mcu_core; ComponentLink3Description: Package Specification; PackageDescription: 4-Pin SMD, Body 6 x 3.6 mm, Pitch 4.4 mm; DatasheetVersion: Jan-13; ComponentLink1URL: http://www.abracon.com/; ComponentLink2URL: http://www.abracon.com/Resonators/ABMM2.pdf; Temperature Range: -20 to 70 degC; Mounting Technology: Surface Mount; RoHS: TRUE; ComponentLink2Description: Datasheet; ComponentLink3URL: http://www.abracon.com/Resonators/ABMM2.pdf; ComponentLink1Description: Manufacturer URL; Packing: 1000pcs / Reel

## Sheet mcu_peripheral.SchDoc
size A4; SheetNumber: 5; SheetTotal: 6
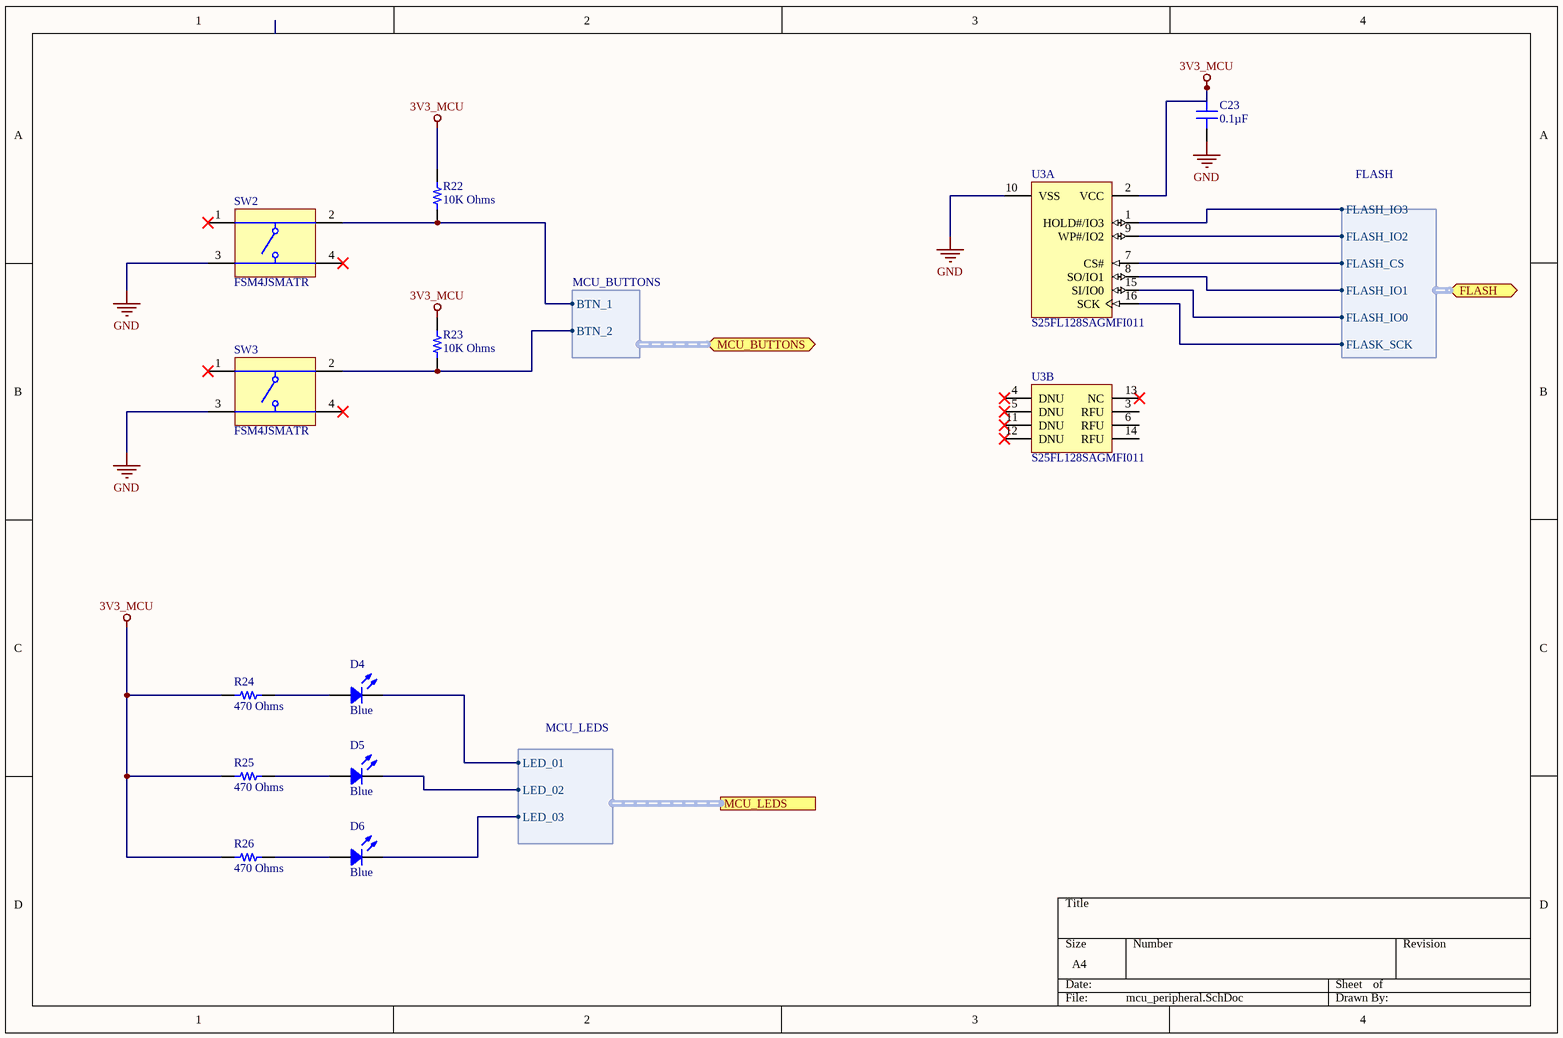
[diagram p3: mcu_peripheral.SchDoc]

### Parts
C23  0.1µF  [CAP 0603_1608]
D4  Blue  [LED 0603_1608 BLUE]
D5  Blue  [LED 0603_1608 BLUE]
D6  Blue  [LED 0603_1608 BLUE]
R22  10K Ohms  [RES 0603_1608]
R23  10K Ohms  [RES 0603_1608]
R24  470 Ohms  [RES 0603_1608]
R25  470 Ohms  [RES 0603_1608]
R26  470 Ohms  [RES 0603_1608]
SW2  FSM4JSMATR  [TECO-FSM4JSMATR_V]
SW3  FSM4JSMATR  [TECO-FSM4JSMATR_V]
U3  S25FL128SAGMFI011  [SPSN-SOIC-16_L]  (parts A,B of 2)

### Ports
FLASH (bidir, harness FLASH), MCU_BUTTONS (bidir, harness MCU_BUTTONS), MCU_LEDS (harness MCU_LEDS)

### Harnesses
MCU_LEDS: LED_01, LED_02, LED_03
FLASH: FLASH_IO3, FLASH_IO2, FLASH_CS, FLASH_IO1, FLASH_IO0, FLASK_SCK
MCU_BUTTONS: BTN_1, BTN_2

### Nets
3V3_MCU: C23.2 R22.2 R23.2 R24.1 R25.1 R26.1 U3.2(VCC)
GND: C23.1 SW2.3 SW3.3 U3.10(VSS)
NetD4_1: D4.1 R24.2
NetD4_2: D4.2 ; port MCU_LEDS.LED_01
NetD5_1: D5.1 R25.2
NetD5_2: D5.2 ; port MCU_LEDS.LED_02
NetD6_1: D6.1 R26.2
NetD6_2: D6.2 ; port MCU_LEDS.LED_03
NetIC1_36: R23.1 SW3.2 ; port MCU_BUTTONS.BTN_2
NetIC1_37: R22.1 SW2.2 ; port MCU_BUTTONS.BTN_1
NetIC1_51: U3.1(HOLD#/IO3) ; port FLASH.FLASH_IO3
NetIC1_52: U3.16(SCK) ; port FLASH.FLASK_SCK
NetIC1_53: U3.15(SI/IO0) ; port FLASH.FLASH_IO0
NetIC1_54: U3.9(WP#/IO2) ; port FLASH.FLASH_IO2
NetIC1_55: U3.8(SO/IO1) ; port FLASH.FLASH_IO1
NetIC1_56: U3.7(CS#) ; port FLASH.FLASH_CS

Not connected (* = marked no-connect by the designer): SW2 1* 4*; SW3 1* 4*; U3 3(RFU) 4(DNU)* 5(DNU)* 6(RFU) 11(DNU)* 12(DNU)* 13(NC)* 14(RFU)

### Library data of the parts
C23 = C0603C104K5RAC7411: as C3 on sheet mcu_core; Part Number: C0603C104K5RAC7411; Value: 0.1µF; Applications: Bypass, Decoupling; Capacitance: 0.1µF; ComponentLink1Description: Datasheet; ComponentLink1URL: https://api.kemet.com/component-edge/download/datasheet/C0603C104K5RAC7411.pdf; ComponentLink2Description: DigiKey Link; ComponentLink2URL: http://digikey.com/product-detail/en/kemet/C0603C104K5RAC7411/399-7374-2-ND/3317013; Device Package: 0603 (1608 Metric); LastUpdated: 02.09.2020 1:03:36; Lifecycle Status: Active; Minimum Order: 15000; Mounting Type: Surface Mount, MLCC; Operating Temperature: -55°C ~ 125°C; Package / Case: 0603 (1608 Metric); Packaging: TapeAndReel; PartId: 2233; Part Status: Active; Price: 0.02; Series: SMD Comm X7R; Size / Dimension: 0.063" L x 0.031" W (1.60mm x 0.80mm); Supplier 1: DigiKey; Supplier Part Number 1: 399-7374-2-ND; Temperature Coefficient: X7R; Thickness (Max): 0.035" (0.90mm); Voltage - Rated: 50V
D4-D6 = VLMB1300-GS08: as D1 on sheet mcu_debug; Part Number: VLMB1300-GS08; Color: Blue; ComponentLink1Description: Datasheet; ComponentLink1URL: http://www.vishay.com/docs/82437/vlmo1300.pdf; ComponentLink2Description: DigiKey Link; ComponentLink2URL: http://digikey.com/product-detail/en/vishay-semiconductor-opto-division/VLMB1300-GS08/VLMB1300-GS08CT-ND/3025485; Device Package: 0603 (1608 Metric); Height (Max): 1.00mm; LastUpdated: 02.09.2020 1:20:26; Lifecycle Status: Active; Minimum Order: 1; Mounting Type: Surface Mount; Package / Case: 0603 (1608 Metric); Packaging: TapeAndReel; PartId: 785; Part Status: Active; Price: 0.08; Series: CHIPLED; Size / Dimension: 1.60mm L x 0.80mm W; Supplier 1: DigiKey; Supplier Part Number 1: VLMB1300-GS08CT-ND; Supplier Device Package: 0603; Value: Blue
R22 R23 = CRCW0603470RJNEAHP: RES SMD 470 OHM 5% 1/4W 0603; Manufacturer: Vishay Dale; Power (Watts): 0.25W, 1/4W; Resistance: 470 Ohms; Temperature Coefficient: ±200ppm/°C; Part Number: CRCW0603470RJNEAHP; Value: 10K Ohms; ComponentLink1Description: Datasheet; ComponentLink1URL: http://www.vishay.com/docs/20043/crcwhpe3.pdf; ComponentLink2Description: DigiKey Link; ComponentLink2URL: http://digikey.com/product-detail/en/vishay-dale/CRCW0603470RJNEAHP/541-470SACT-ND/2222809; Composition: Thick Film; Device Package: 0603 (1608 Metric); Features: Automotive AEC-Q200, Pulse Withstanding; Height - Seated (Max): 0.022" (0.55mm); LastUpdated: 02.09.2020 1:09:49; Lifecycle Status: Active; Minimum Order: 1; Number of Terminations: 2; Operating Temperature: -55°C ~ 155°C; Package / Case: 0603 (1608 Metric); Packaging: TapeAndReel; PartId: 21320; Part Status: Active; Price: 0.02; Ratings: AEC-Q200; Series: CRCW-HP; Size / Dimension: 0.063" L x 0.033" W (1.60mm x 0.85mm); Supplier Device Package: 0603; Tolerance: ±5%; Supplier 1: Farnell; Supplier Part Number 1: 3495224
R24-R26 = CRCW0603470RJNEAHP: as R12 on sheet mcu_debug; Part Number: CRCW0603470RJNEAHP; Value: 470 Ohms; ComponentLink1Description: Datasheet; ComponentLink1URL: http://www.vishay.com/docs/20043/crcwhpe3.pdf; ComponentLink2Description: DigiKey Link; ComponentLink2URL: http://digikey.com/product-detail/en/vishay-dale/CRCW0603470RJNEAHP/541-470SACT-ND/2222809; Composition: Thick Film; Device Package: 0603 (1608 Metric); Features: Automotive AEC-Q200, Pulse Withstanding; Height - Seated (Max): 0.022" (0.55mm); LastUpdated: 02.09.2020 1:09:49; Lifecycle Status: Active; Minimum Order: 1; Number of Terminations: 2; Operating Temperature: -55°C ~ 155°C; Package / Case: 0603 (1608 Metric); Packaging: TapeAndReel; PartId: 21320; Part Status: Active; Price: 0.02; Ratings: AEC-Q200; Resistance: 470 Ohms; Series: CRCW-HP; Size / Dimension: 0.063" L x 0.033" W (1.60mm x 0.85mm); Supplier 1: DigiKey; Supplier Part Number 1: 541-470SACT-ND; Supplier Device Package: 0603; Tolerance: ±5%
SW2 SW3 = CMP-2000-07486-1: as SW1 on sheet mcu_debug; Termination: GullWing; Contact Plating: Silver; Orientation: Straight; Mounting Technology: SurfaceMount; REACH SVHC: Unknown; Electrical Life: 100000Cycles; Package Reference: FSM4JSMATR; Max Operating Temperature: 85degC; Manufacturer URL: http://www.te.com/; Package Description: 4-Pin Surface Mount Device, Body 6 x 6 mm, Pitch 4.5 mm; Datasheet Version: Rev. V, 02/2015; Packaging: TapeandReel; Min Operating Temperature: -35degC; Mount: SurfaceMount; Contact Current Rating: 50mA; Contact Material: CopperAlloy; Package Quantity: 1200; Datasheet URL: http://www.te.com/commerce/DocumentDelivery/DDEController?Action=showdoc&DocId=Customer+Drawing%7F2-1437565-7%7FV%7Fpdf%7FEnglish%7FENG_CD_2-1437565-7_V.pdf%7F4-1437565-2; RoHSCompliant: true
U3 = CMP-1329-00018-1: MirrorBit Flash Non-Volatile Memory CMOS 3.0 Volt Core with Versatile I/O, Serial Peripheral Interface with Multi-I/O, 128 Mbit, 133 MHz, -40 to 85 degC, 16-Pin SO (SO3016), RoHS, Tube; Manufacturer: Spansion; OTP: 1024 B; VCC: 2.7 to 3.6 V; Speed: 133 MHz; PackageDescription: 16-Pin Wide Plastic Small Outline Package, Body 10.3 x 7.5 mm, Pitch 1.27 mm; Density: 128 Mbit; ComponentLink3URL: http://www.spansion.com/Support/Datasheets/S25FL128S_256S_00.pdf; DatasheetVersion: Rev. 08; ComponentLink2Description: Datasheet; ComponentLink3Description: Package Specification; PartNumber: S25FL128SAGMFI011; ComponentLink1Description: Manufacturer URL; ComponentLink1URL: http://www.spansion.com/Pages/Default.aspx; Mounting Technology: Surface Mount; Temperature Range: -40 to 85 degC; ComponentLink2URL: http://www.spansion.com/Support/Datasheets/S25FL128S_256S_00.pdf; RoHS: TRUE; Packing: Tube

## Sheet mcu_power.SchDoc
size A4; SheetNumber: 6; SheetTotal: 6
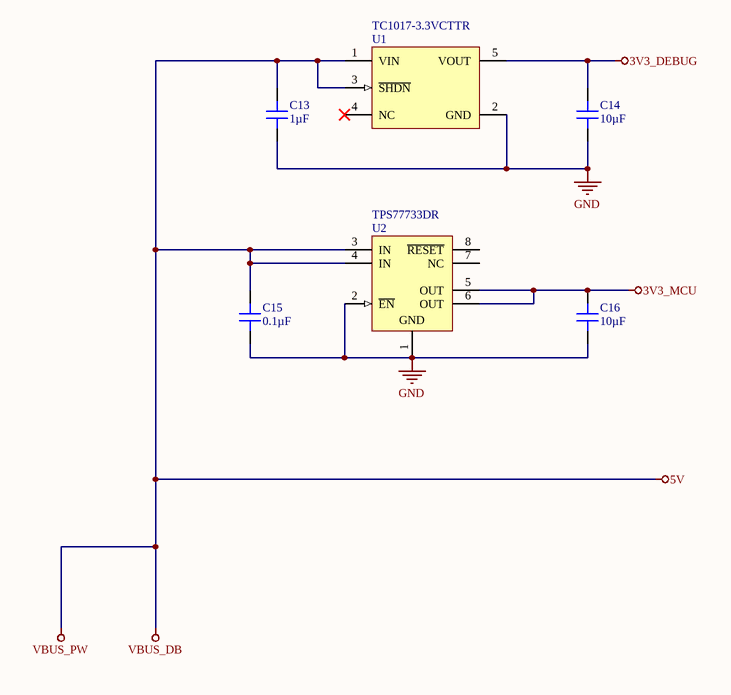
[diagram p4: mcu_power.SchDoc]

### Parts
C13  1µF  [CAP 0603_1608]
C14  10µF  [CAP 0603_1608]
C15  0.1µF  [CAP 0603_1608]
C16  10µF  [CAP 0603_1608]
U1  TC1017-3.3VCTTR  [SOT-23-CT5_L]
U2  TPS77733DR  [D0008A_N]

### Nets
3V3_DEBUG: C14.2 U1.5(VOUT)
3V3_MCU: C16.2 U2.5(OUT) U2.6(OUT)
5V: C13.2 C15.2 U1.1(VIN) U1.3(~{SHDN}) U2.3(IN) U2.4(IN)  [also labelled VBUS_DB, VBUS_PW]
GND: C13.1 C14.1 C15.1 C16.1 U1.2(GND) U2.1(GND) U2.2(~{EN})

Not connected (* = marked no-connect by the designer): U1 4(NC)*; U2 7(NC) 8(~{RESET})

### Library data of the parts
C13 = C0603X105M4RACAUTO: CAP CER 0603 1UF 16V X7R 20%; Manufacturer: KEMET; Part Number: C0603X105M4RACAUTO; Value: 1µF; Applications: Automotive, Boardflex Sensitive; Capacitance: 1µF; ComponentLink1Description: Datasheet; ComponentLink1URL: https://api.kemet.com/component-edge/download/datasheet/C0603X105M4RACAUTO.pdf; ComponentLink2Description: DigiKey Link; ComponentLink2URL: http://digikey.com/product-detail/en/kemet/C0603X105M4RACAUTO/399-17719-1-ND/8635870; Device Package: 0603 (1608 Metric); Features: Soft Termination; LastUpdated: 02.09.2020 1:03:33; Lifecycle Status: Active; Minimum Order: 1; Mounting Type: Surface Mount, MLCC; Operating Temperature: -55°C ~ 125°C; Package / Case: 0603 (1608 Metric); Packaging: TapeAndReel; PartId: 3927; Part Status: Active; Price: 0.07; Ratings: AEC-Q200; Series: SMD Auto X7R Flex; Size / Dimension: 0.063" L x 0.031" W (1.60mm x 0.80mm); Supplier 1: DigiKey; Supplier Part Number 1: 399-17719-1-ND; Temperature Coefficient: X7R; Thickness (Max): 0.037" (0.95mm); Tolerance: ±20%; Voltage - Rated: 16V
C14 C16 = GRT188R61C106KE13D: CAP CER 10UF 16V X5R 0603; Manufacturer: Murata Electronics; Tolerance: ±10%; Part Number: GRT188R61C106KE13D; Value: 10µF; Applications: Automotive; Capacitance: 10µF; ComponentLink1Description: Datasheet; ComponentLink1URL: https://search.murata.co.jp/Ceramy/image/img/A01X/G101/ENG/GRT188R61C106KE13-01.pdf; ComponentLink2Description: DigiKey Link; ComponentLink2URL: http://digikey.com/product-detail/en/murata-electronics/GRT188R61C106KE13D/490-12317-1-ND/5417018; Device Package: 0603 (1608 Metric); LastUpdated: 02.09.2020 1:03:11; Lifecycle Status: Active; Minimum Order: 1; Mounting Type: Surface Mount, MLCC; Operating Temperature: -55°C ~ 85°C; Package / Case: 0603 (1608 Metric); Packaging: TapeAndReel; PartId: 14922; Part Status: Active; Price: 0.10; Ratings: AEC-Q200; Series: GRT; Size / Dimension: 0.063" L x 0.031" W (1.60mm x 0.80mm); Supplier 1: DigiKey; Supplier Part Number 1: 490-12317-1-ND; Temperature Coefficient: X5R; Thickness (Max): 0.035" (0.90mm); Voltage - Rated: 16V
C15 = CS0603KRX7R7BB104: CAP CER 0.1UF 16V X7R 0603; Manufacturer: Yageo; Tolerance: ±10%; Part Number: CS0603KRX7R7BB104; Value: 0.1µF; Applications: Boardflex Sensitive; Capacitance: 0.1µF; ComponentLink1Description: Datasheet; ComponentLink1URL: http://www.yageo.com/NewPortal/yageodocoutput?fileName=/pdf/MLCC/UPY-ST_NPOX7R_16V-to-3KV_5.pdf; ComponentLink2Description: DigiKey Link; ComponentLink2URL: http://digikey.com/product-detail/en/yageo/CS0603KRX7R7BB104/311-3560-1-ND/7648487; Device Package: 0603 (1608 Metric); Features: Soft Termination; LastUpdated: 02.09.2020 1:03:36; Lifecycle Status: Active; Minimum Order: 1; Mounting Type: Surface Mount, MLCC; Operating Temperature: -55°C ~ 125°C; Package / Case: 0603 (1608 Metric); Packaging: TapeAndReel; PartId: 2286; Part Status: Active; Price: 0.02; Series: CS; Size / Dimension: 0.063" L x 0.031" W (1.60mm x 0.80mm); Supplier 1: DigiKey; Supplier Part Number 1: 311-3560-1-ND; Temperature Coefficient: X7R; Thickness (Max): 0.037" (0.95mm); Voltage - Rated: 16V
U1 = CMP-0136-00743-1: 150 mA, Tiny CMOS LDO with Shutdown, 5-Pin SOT-23, Extended Temperature, Tape and Reel; Code_IPC: SOT23-5; PackageVersion: revBB, Aug-2009; PackageDescription: 5-Lead Plastic Small Outline Transistor (CT) [SOT-23]; DatasheetVersion: revD, 2005; PackageReference: SOT-23-CT5
U2 = CMP-0395-00062-2: Single Output Fast Transient Response LDO, 750 mA, Fixed 3.3 V Output, 2.7 to 10 V Input, 8-pin SOIC (D), -40 to 125 degC, Green (RoHS & no Sb/Br); Manufacturer: Texas Instruments; Fixed Output Options(V): 3.3; Vin(Max)(V): 10; Vin(Min)(V): 2.7; Iout(Max)(A): 0.75; Iq(Typ)(mA): 0.08; Vdo(Typ)(mV): 260; SubFamily: Single Channel LDO; Accuracy(%): 2; Eco-Plan: Green (RoHS & no Sb/Br); ComponentLink1Description: Manufacturer URL; DatasheetVersion: SLVS230G; PackageVersion: 4040047-3/M; PackageReference: D0008A; ComponentLink2URL: http://www.ti.com/general/docs/lit/getliterature.tsp?genericPartNumber=TPS77733&fileType=pdf; PartNumber: TPS77733DR; ComponentLink3Description: Package Specification; Mounting Technology: Surface Mount; ComponentLink2Description: Datasheet; ComponentLink3URL: http://www.ti.com/litv/pdf/msoi002j; Vout Adj(Max)(V): 3.3; Code_JEDEC: MS-012; Vout Adj(Min)(V): 3.3; PackageDescription: 8-Pin Plastic Small Outline, Body 4.9 x 3.9 mm, Pitch 1.27 mm; ComponentLink1URL: http://www.ti.com/

## Sheet mcu_headers.SchDoc
size A4; SheetNumber: 4; SheetTotal: 6
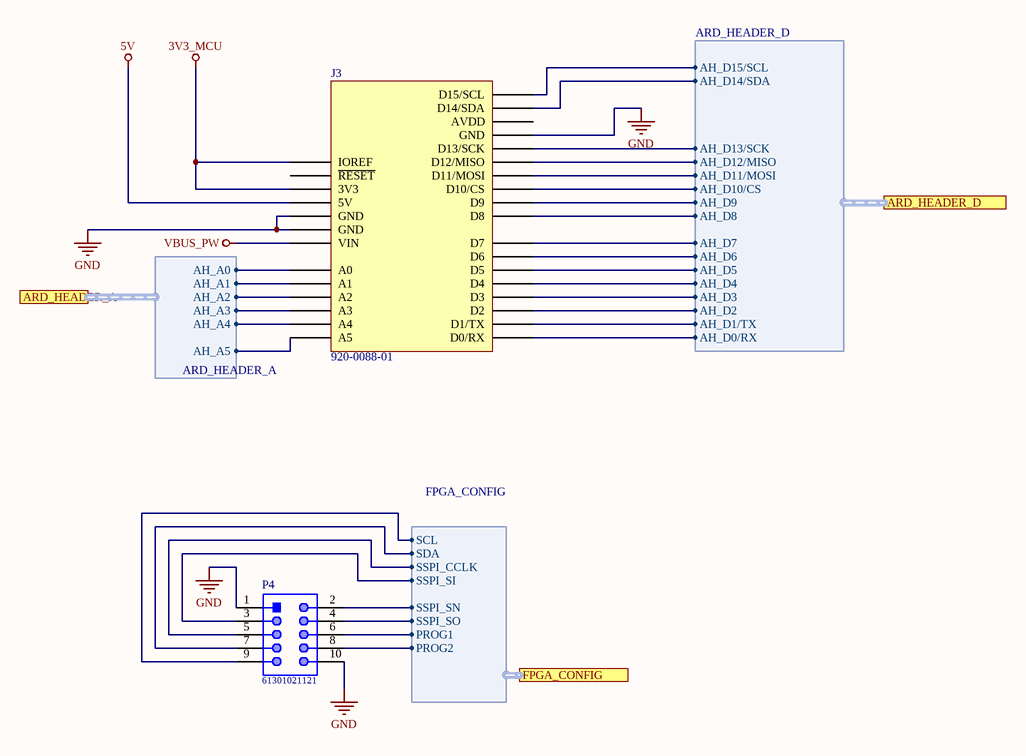
[diagram p5: mcu_headers.SchDoc]

### Parts
J3  920-0088-01  [SCHMARTBOARD - 920-0088-01]
P4  61301021121  [61301021121]

### Ports
ARD_HEADER_A (harness ARD_HEADER_A), ARD_HEADER_D (harness ARD_HEADER_D), FPGA_CONFIG (harness FPGA_CONFIG)

### Harnesses
ARD_HEADER_D: AH_D15/SCL, AH_D14/SDA, AH_D13/SCK, AH_D12/MISO, AH_D11/MOSI, AH_D10/CS, AH_D9, AH_D8, AH_D7, AH_D5, AH_D4, AH_D3, AH_D2, AH_D1/TX, AH_D0/RX, AH_D6
FPGA_CONFIG: SSPI_SN, SSPI_SO, PROG1, PROG2, SSPI_SI, SSPI_CCLK, SDA, SCL
ARD_HEADER_A: AH_A0, AH_A1, AH_A2, AH_A3, AH_A4, AH_A5

### Nets
3V3_MCU: J3.2(IOREF) J3.4(3V3)
5V: J3.5(5V) J3.8(VIN)  [also labelled VBUS_PW]
GND: J3.6(GND) J3.7(GND) J3.29(GND) P4.1 P4.10
NetIC1_2: J3.16(D1/TX) ; port ARD_HEADER_D.AH_D1/TX
NetIC1_3: J3.15(D0/RX) ; port ARD_HEADER_D.AH_D0/RX
NetIC1_4: J3.25(D10/CS) ; port ARD_HEADER_D.AH_D10/CS
NetIC1_5: J3.17(D2) ; port ARD_HEADER_D.AH_D2
NetIC1_6: J3.18(D3) ; port ARD_HEADER_D.AH_D3
NetIC1_7: J3.19(D4) ; port ARD_HEADER_D.AH_D4
NetIC1_8: J3.31(D14/SDA) ; port ARD_HEADER_D.AH_D14/SDA
NetIC1_9: J3.32(D15/SCL) ; port ARD_HEADER_D.AH_D15/SCL
NetIC1_14: J3.23(D8) ; port ARD_HEADER_D.AH_D8
NetIC1_15: J3.24(D9) ; port ARD_HEADER_D.AH_D9
NetIC1_16: J3.26(D11/MOSI) ; port ARD_HEADER_D.AH_D11/MOSI
NetIC1_17: J3.27(D12/MISO) ; port ARD_HEADER_D.AH_D12/MISO
NetIC1_18: J3.28(D13/SCK) ; port ARD_HEADER_D.AH_D13/SCK
NetIC1_27: P4.4 ; port FPGA_CONFIG.SSPI_SO
NetIC1_28: P4.2 ; port FPGA_CONFIG.SSPI_SN
NetIC1_29: P4.7 ; port FPGA_CONFIG.SDA
NetIC1_30: P4.9 ; port FPGA_CONFIG.SCL
NetIC1_31: P4.8 ; port FPGA_CONFIG.PROG2
NetIC1_32: P4.6 ; port FPGA_CONFIG.PROG1
NetIC1_34: P4.5 ; port FPGA_CONFIG.SSPI_CCLK
NetIC1_35: P4.3 ; port FPGA_CONFIG.SSPI_SI
NetIC1_38: J3.9(A0) ; port ARD_HEADER_A.AH_A0
NetIC1_39: J3.10(A1) ; port ARD_HEADER_A.AH_A1
NetIC1_40: J3.11(A2) ; port ARD_HEADER_A.AH_A2
NetIC1_41: J3.12(A3) ; port ARD_HEADER_A.AH_A3
NetJ3_13: J3.13(A4) ; port ARD_HEADER_A.AH_A4
NetJ3_14: J3.14(A5) ; port ARD_HEADER_A.AH_A5
NetJ3_20: J3.20(D5) ; port ARD_HEADER_D.AH_D5
NetJ3_21: J3.21(D6) ; port ARD_HEADER_D.AH_D6
NetJ3_22: J3.22(D7) ; port ARD_HEADER_D.AH_D7

Not connected (* = marked no-connect by the designer): J3 3(~{RESET}) 30(AVDD)

### Library data of the parts
J3 = 920-0088-01: CONN HDR 8/10P 0.1 GOLD PCB 6PC; Manufacturer: Schmartboard, Inc.; Connector Type: Header; Contact Length - Post: 0.413" (10.50mm); Number of Positions: 6, 8, 10; Number of Positions Loaded: All; Pitch - Mating: 0.100" (2.54mm); Style: Board to Board; Part Number: 920-0088-01; ComponentLink1Description: Datasheet; ComponentLink1URL: http://schmartboard.com/content/Brochures/920-0088-01.pdf; ComponentLink2Description: DigiKey Link; ComponentLink2URL: http://digikey.com/product-detail/en/schmartboard-inc/920-0088-01/1988-1036-ND/9559319; Contact Finish - Mating: Gold; Contact Finish - Post: Gold; Contact Type: Female Socket; Fastening Type: Push-Pull; Insulation Color: Black; Insulation Height: 0.335" (8.51mm); LastUpdated: 31.01.2020 20:49:58; Lifecycle Status: Active; Minimum Order: 1; Mounting Type: Through Hole; Number of Rows: 1; Packaging: Bulk; Part Status: Active; Price: 5.00; Series: -; Supplier 1: DigiKey; Supplier Part Number 1: 1988-1036-ND; Termination: Solder
P4 = CMP-1502-01084-1: as P1 on sheet mcu_core; Operating Temperature: -40to105degC; Mounting Technology: THT; Publisher: WurthElektronik; Manufacturer URL: http://www.we-online.de; Part Number: 61301021121; Row Number: Dual; Packaging: Bag; Orientation: Vertical; Package Reference: 61301021121; Datasheet URL: https://katalog.we-online.de/em/datasheet/6130xx21121.pdf

## Nets that join several sheets
3V3_DEBUG: mcu_debug (9 pins), mcu_power (C14.2 U1.5)
3V3_MCU: mcu_core (21 pins), mcu_peripheral (7 pins), mcu_power (C16.2 U2.5 U2.6), mcu_headers (J3.2 J3.4)
5V: mcu_core (J1.1), mcu_debug (J2.1), mcu_power (6 pins), mcu_headers (J3.5 J3.8)
GND: mcu_core (21 pins), mcu_debug (11 pins), mcu_peripheral (C23.1 SW2.3 SW3.3 U3.10), mcu_power (7 pins), mcu_headers (5 pins)
NetD4_2: mcu_core (R9.1), mcu_peripheral (D4.2)
NetD5_2: mcu_core (R7.1), mcu_peripheral (D5.2)
NetD6_2: mcu_core (R5.1), mcu_peripheral (D6.2)
NetIC1_2: mcu_core (IC1.2), mcu_headers (J3.16)
NetIC1_3: mcu_core (IC1.3), mcu_headers (J3.15)
NetIC1_4: mcu_core (IC1.4), mcu_headers (J3.25)
NetIC1_5: mcu_core (IC1.5), mcu_headers (J3.17)
NetIC1_6: mcu_core (IC1.6), mcu_headers (J3.18)
NetIC1_7: mcu_core (IC1.7), mcu_headers (J3.19)
NetIC1_8: mcu_core (IC1.8), mcu_headers (J3.31)
NetIC1_9: mcu_core (IC1.9), mcu_headers (J3.32)
NetIC1_14: mcu_core (IC1.14), mcu_headers (J3.23)
NetIC1_15: mcu_core (IC1.15), mcu_headers (J3.24)
NetIC1_16: mcu_core (IC1.16), mcu_headers (J3.26)
NetIC1_17: mcu_core (IC1.17), mcu_headers (J3.27)
NetIC1_18: mcu_core (IC1.18), mcu_headers (J3.28)
NetIC1_24: mcu_core (5 pins), mcu_debug (R17.2)
NetIC1_25: mcu_core (IC1.25 P1.2), mcu_debug (R18.2)
NetIC1_27: mcu_core (IC1.27), mcu_headers (P4.4)
NetIC1_28: mcu_core (IC1.28), mcu_headers (P4.2)
NetIC1_29: mcu_core (IC1.29), mcu_headers (P4.7)
NetIC1_30: mcu_core (IC1.30), mcu_headers (P4.9)
NetIC1_31: mcu_core (IC1.31), mcu_headers (P4.8)
NetIC1_32: mcu_core (IC1.32), mcu_headers (P4.6)
NetIC1_34: mcu_core (IC1.34), mcu_headers (P4.5)
NetIC1_35: mcu_core (IC1.35), mcu_headers (P4.3)
NetIC1_36: mcu_core (IC1.36), mcu_peripheral (R23.1 SW3.2)
NetIC1_37: mcu_core (IC1.37), mcu_peripheral (R22.1 SW2.2)
NetIC1_38: mcu_core (IC1.38), mcu_headers (J3.9)
NetIC1_39: mcu_core (IC1.39), mcu_headers (J3.10)
NetIC1_40: mcu_core (IC1.40), mcu_headers (J3.11)
NetIC1_41: mcu_core (IC1.41), mcu_headers (J3.12)
NetIC1_51: mcu_core (IC1.51), mcu_peripheral (U3.1)
NetIC1_52: mcu_core (IC1.52), mcu_peripheral (U3.16)
NetIC1_53: mcu_core (IC1.53), mcu_peripheral (U3.15)
NetIC1_54: mcu_core (IC1.54), mcu_peripheral (U3.9)
NetIC1_55: mcu_core (IC1.55), mcu_peripheral (U3.8)
NetIC1_56: mcu_core (IC1.56), mcu_peripheral (U3.7)
NetJ3_20: mcu_core (R6.2), mcu_headers (J3.20)
NetJ3_21: mcu_core (R8.2), mcu_headers (J3.21)
NetJ3_22: mcu_core (R10.2), mcu_headers (J3.22)
NetP1_10: mcu_core (P1.10), mcu_debug (R20.2)